# EAGLE design Voicecard-SMRMU-v01 (EAGLE 9.6.2)
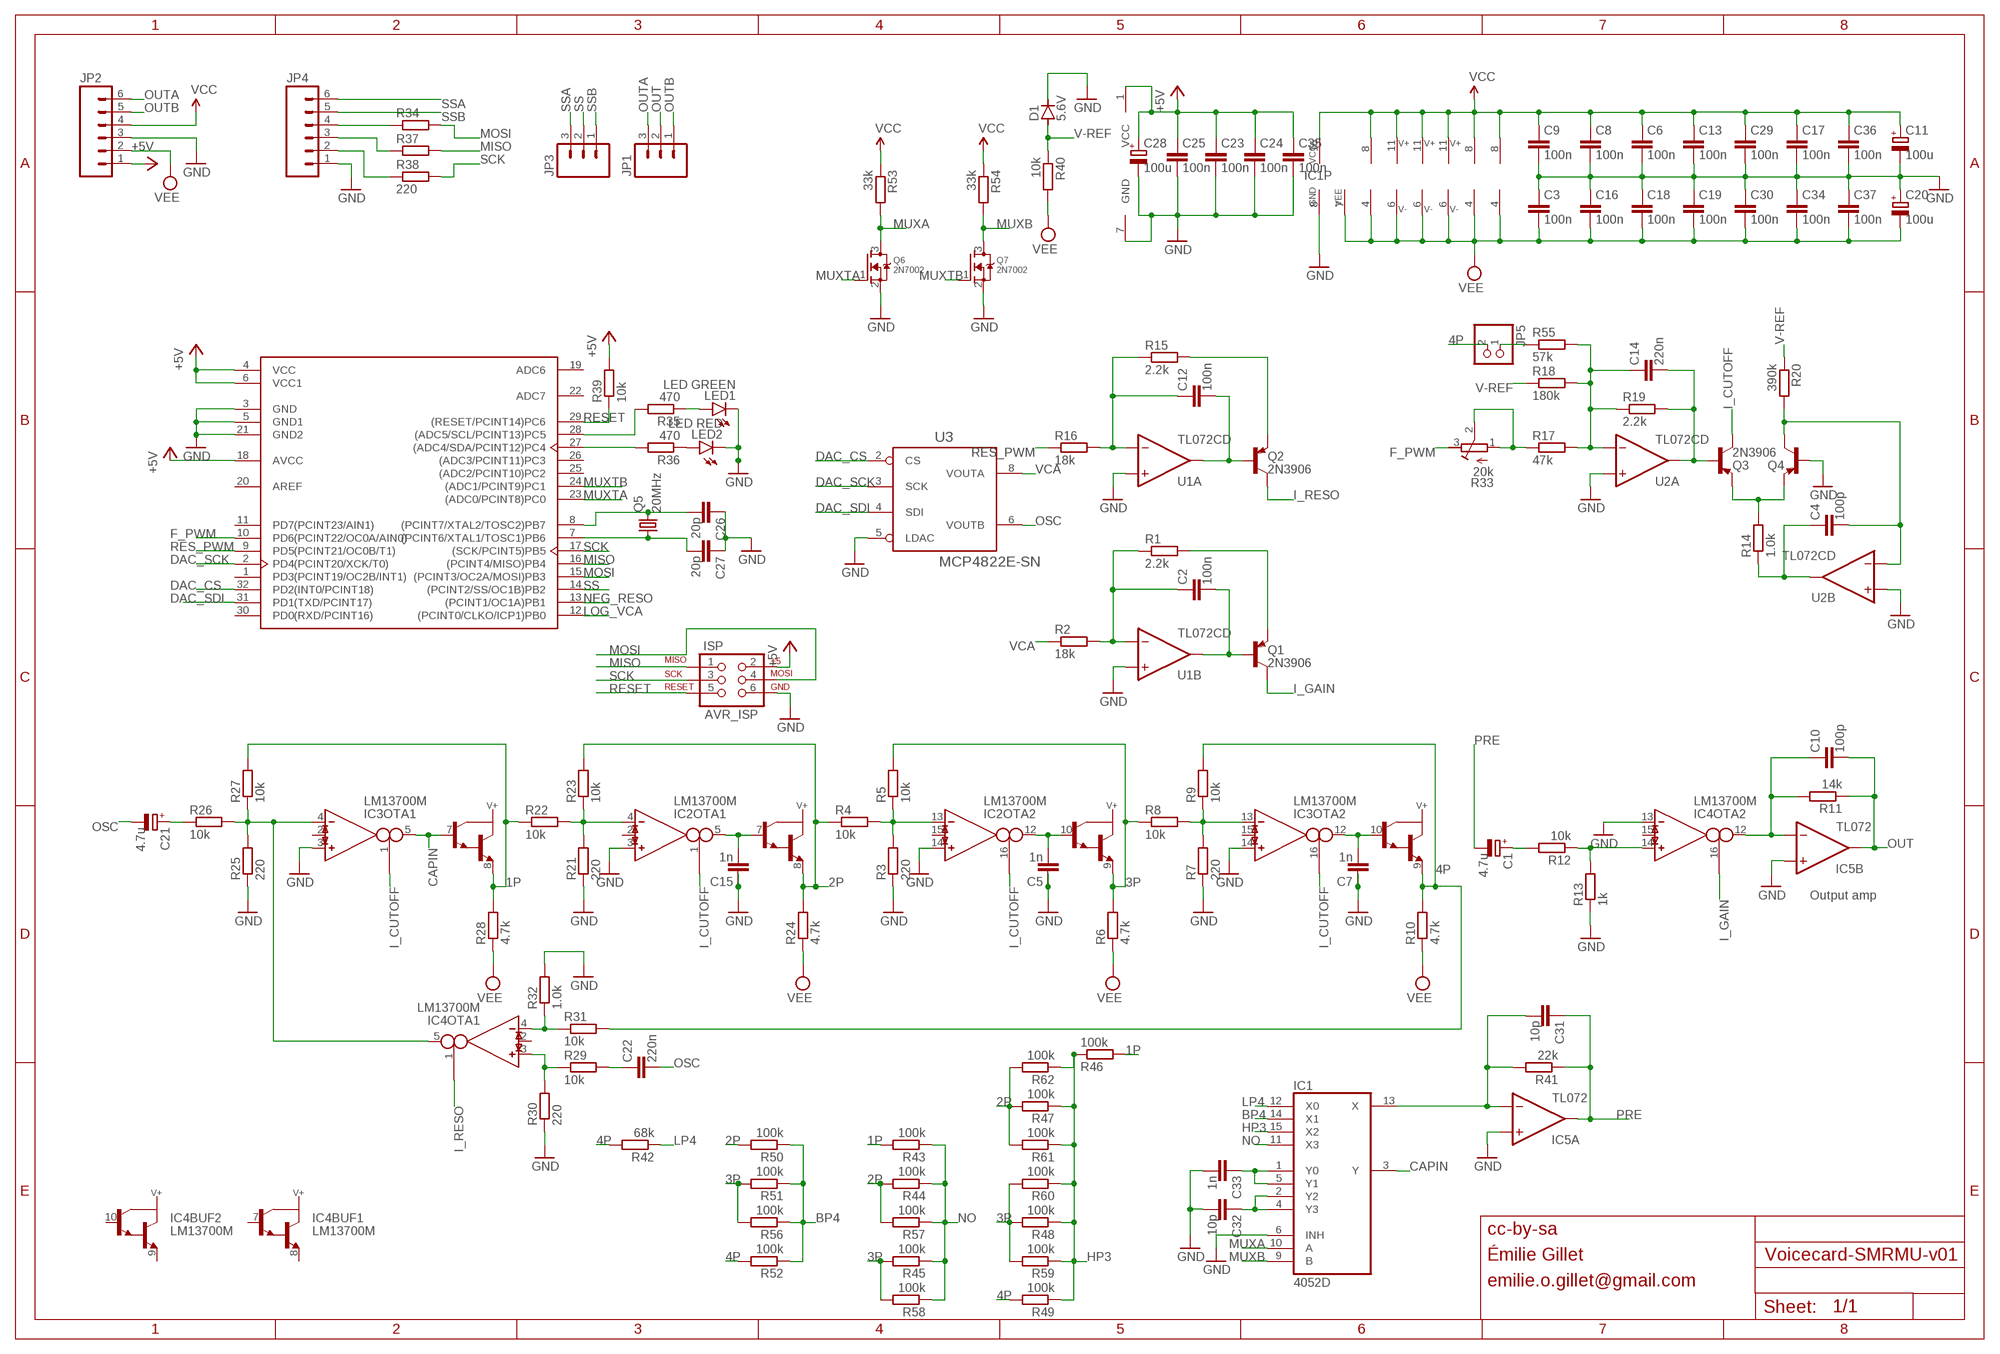
[diagram p0: schematic, sheet 1]

## Parts
C1  4.7u  CPOL-EUUD-5X5,8  [UD-5X5,8_NICHICON]
C2  100n  C-EUC0603  [C0603]
C3  100n  C-EUC0603  [C0603]
C4  100p  C-EUC0603  [C0603]
C5  1n  C-EUC0603  [C0603]
C6  100n  C-EUC0603  [C0603]
C7  1n  C-EUC0603  [C0603]
C8  100n  C-EUC0603  [C0603]
C9  100n  C-EUC0603  [C0603]
C10  100p  C-EUC0603  [C0603]
C11  100u  CPOL-EUUD-6,3X7,7  [UD-6,3X7,7_NICHICON]
C12  100n  C-EUC0603  [C0603]
C13  100n  C-EUC0603  [C0603]
C14  220n  C-EUC0603  [C0603]
C15  1n  C-EUC0603  [C0603]
C16  100n  C-EUC0603  [C0603]
C17  100n  C-EUC0603  [C0603]
C18  100n  C-EUC0603  [C0603]
C19  100n  C-EUC0603  [C0603]
C20  100u  CPOL-EUUD-6,3X7,7  [UD-6,3X7,7_NICHICON]
C21  4.7u  CPOL-EUUD-5X5,8  [UD-5X5,8_NICHICON]
C22  220n  C-EUC0603  [C0603]
C23  100n  C-EUC0603  [C0603]
C24  100n  C-EUC0603  [C0603]
C25  100n  C-EUC0603  [C0603]
C26  20p  C-EUC0603  [C0603]
C27  20p  C-EUC0603  [C0603]
C28  100u  CPOL-EUUD-6,3X7,7  [UD-6,3X7,7_NICHICON]
C29  100n  C-EUC0603  [C0603]
C30  100n  C-EUC0603  [C0603]
C31  10p  C-EUC0603  [C0603]
C32  10p  C-EUC0603  [C0603]
C33  1n  C-EUC0603  [C0603]
C34  100n  C-EUC0603  [C0603]
C35  100n  C-EUC0603  [C0603]
C36  100n  C-EUC0603  [C0603]
C37  100n  C-EUC0603  [C0603]
D1  5.6V  DIODE-LL-34  [MELF-MLL34]
IC1  4052D  [SOIC16N]
IC2  LM13700M  [SO16]
IC3  LM13700M  [SO16]
IC4  LM13700M  [SO16]
IC5  TL072  TL072CD  [SOIC8]
ISP  AVR_ISP  AVR_SPI_PRG_6PTH  [2X3]
JP1  M03PTH  [1X03]
JP2  M06SIP  [1X06]
JP3  M03PTH  [1X03]
JP4  M06SIP  [1X06]
JP5  PINHD-1X2  [1X02]
LED1  LED GREEN  LEDCHIP-LED0603  [CHIP-LED0603]
LED2  LED RED  LEDCHIP-LED0603  [CHIP-LED0603]
Q1  2N3906  MMBT3906LT1-PNP-SOT23-BEC  [SOT23-BEC]
Q2  2N3906  MMBT3906LT1-PNP-SOT23-BEC  [SOT23-BEC]
Q3  2N3906  MMBT3906LT1-PNP-SOT23-BEC  [SOT23-BEC]
Q4  2N3906  MMBT3906LT1-PNP-SOT23-BEC  [SOT23-BEC]
Q5  20MHz  CRYSTALHC49UP  [HC49UP]
Q6  2N7002  MOSFET-NREFLOW  [SOT23]
Q7  2N7002  MOSFET-NREFLOW  [SOT23]
R1  2.2k  R-EU_R0603  [R0603]
R2  18k  R-EU_R0603  [R0603]
R3  220  R-EU_R0603  [R0603]
R4  10k  R-EU_R0603  [R0603]
R5  10k  R-EU_R0603  [R0603]
R6  4.7k  R-EU_R0603  [R0603]
R7  220  R-EU_R0603  [R0603]
R8  10k  R-EU_R0603  [R0603]
R9  10k  R-EU_R0603  [R0603]
R10  4.7k  R-EU_R0603  [R0603]
R11  14k  R-EU_R0603  [R0603]
R12  10k  R-EU_R0603  [R0603]
R13  1k  R-EU_R0603  [R0603]
R14  1.0k  R-EU_R0603  [R0603]
R15  2.2k  R-EU_R0603  [R0603]
R16  18k  R-EU_R0603  [R0603]
R17  47k  R-EU_R0603  [R0603]
R18  180k  R-EU_R0603  [R0603]
R19  2.2k  R-EU_R0603  [R0603]
R20  390k  R-EU_R0603  [R0603]
R21  220  R-EU_R0603  [R0603]
R22  10k  R-EU_R0603  [R0603]
R23  10k  R-EU_R0603  [R0603]
R24  4.7k  R-EU_R0603  [R0603]
R25  220  R-EU_R0603  [R0603]
R26  10k  R-EU_R0603  [R0603]
R27  10k  R-EU_R0603  [R0603]
R28  4.7k  R-EU_R0603  [R0603]
R29  10k  R-EU_R0603  [R0603]
R30  220  R-EU_R0603  [R0603]
R31  10k  R-EU_R0603  [R0603]
R32  1.0k  R-EU_R0603  [R0603]
R33  20k  R-TRIMM3296P  [RTRIM3296P]
R34  220  R-EU_R0603  [R0603]
R35  470  R-EU_R0603  [R0603]
R36  470  R-EU_R0603  [R0603]
R37  220  R-EU_R0603  [R0603]
R38  220  R-EU_R0603  [R0603]
R39  10k  R-EU_R0603  [R0603]
R40  10k  R-EU_R0603  [R0603]
R41  22k  R-EU_R0603  [R0603]
R42  68k  R-EU_R0603  [R0603]
R43  100k  R-EU_R0603  [R0603]
R44  100k  R-EU_R0603  [R0603]
R45  100k  R-EU_R0603  [R0603]
R46  100k  R-EU_R0603  [R0603]
R47  100k  R-EU_R0603  [R0603]
R48  100k  R-EU_R0603  [R0603]
R49  100k  R-EU_R0603  [R0603]
R50  100k  R-EU_R0603  [R0603]
R51  100k  R-EU_R0603  [R0603]
R52  100k  R-EU_R0603  [R0603]
R53  33k  R-EU_R0603  [R0603]
R54  33k  R-EU_R0603  [R0603]
R55  57k  R-EU_R0603  [R0603]
R56  100k  R-EU_R0603  [R0603]
R57  100k  R-EU_R0603  [R0603]
R58  100k  R-EU_R0603  [R0603]
R59  100k  R-EU_R0603  [R0603]
R60  100k  R-EU_R0603  [R0603]
R61  100k  R-EU_R0603  [R0603]
R62  100k  R-EU_R0603  [R0603]
U1  TL072CD  [SOIC8]
U2  TL072CD  [SOIC8]
U3  MCP4822E-SN  [SOIC8]
U4  ATMEGA328P-AU  [TQFP-32]

## Nets
1P: IC3.8(BUF1:E) R22.1 R27.2 R28.2 R43.2 R46.2
2P: IC2.8(BUF1:E) R4.1 R23.2 R24.2 R44.2 R47.2 R50.2 R57.2 R61.2 R62.2
3P: IC2.9(BUF2:E) R5.2 R6.2 R8.1 R45.2 R48.2 R51.2 R56.2 R58.2 R59.2 R60.2
4P: IC3.9(BUF2:E) JP5.2 R9.2 R10.2 R31.2 R42.2 R49.2 R52.2
+5V: C23.1 C24.1 C25.1 C28.+ C35.1 ISP.2 JP2.1 R39.2 U3.1(VCC) U4.4(VCC) U4.6(VCC1) U4.18(AVCC)
BP4: IC1.14(X1) R50.1 R51.1 R52.1 R56.1
CAPIN: IC1.3(Y) IC3.5(OTA1:OUT) IC3.7(BUF1:B)
DAC_CS: U3.2(CS) U4.32(PD2(INT0/PCINT18))
DAC_SCK: U3.3(SCK) U4.2(PD4(PCINT20/XCK/T0))
DAC_SDI: U3.4(SDI) U4.31(PD1(TXD/PCINT17))
F_PWM: R33.3(E) U4.10(PD6(PCINT22/OC0A/AIN0))
GND: C3.1 C5.1 C6.2 C7.1 C8.2 C9.2 C11.- C13.2 C15.1 C16.1 C17.2 C18.1 C19.1 C20.+ C23.2 C24.2 C25.2 C26.1 C27.1 C28.- C29.2 C30.1 C32.2 C33.2 C34.1 C35.2 C36.2 C37.1 D1.1(C) IC1.6(INH) IC1.8(GND) IC2.3(OTA1:IN_P) IC2.14(OTA2:IN_P) IC3.3(OTA1:IN_P) IC3.14(OTA2:IN_P) IC4.13(OTA2:IN_N) IC5.3(A:+IN) IC5.5(B:+IN) ISP.6 JP2.3 JP4.1 LED1.C LED2.C Q4.B Q6.2(S) Q7.2(S) R3.1 R7.1 R13.1 R21.1 R25.1 R30.1 R32.2 U1.3(A:+IN) U1.5(B:+IN) U2.3(A:+IN) U2.5(B:+IN) U3.5(LDAC) U3.7(GND) U4.3(GND) U4.5(GND1) U4.21(GND2)
HP3: IC1.15(X2) R46.1 R47.1 R48.1 R49.1 R59.1 R60.1 R61.1 R62.1
I_CUTOFF: IC2.1(OTA1:I_BIAS) IC2.16(OTA2:I_BIAS) IC3.1(OTA1:I_BIAS) IC3.16(OTA2:I_BIAS) Q3.C
I_GAIN: IC4.16(OTA2:I_BIAS) Q1.C
I_RESO: IC4.1(OTA1:I_BIAS) Q2.C
LOG_VCA: U4.12((PCINT0/CLKO/ICP1)PB0)
LP4: IC1.12(X0) R42.1
MISO: ISP.1 R37.2 U4.16((PCINT4/MISO)PB4)
MOSI: ISP.4 R34.2 U4.15((PCINT3/OC2A/MOSI)PB3)
MUXA: IC1.10(A) Q6.3(D) R53.2
MUXB: IC1.9(B) Q7.3(D) R54.2
MUXTA: Q6.1(G) U4.23((ADC0/PCINT8)PC0)
MUXTB: Q7.1(G) U4.24((ADC1/PCINT9)PC1)
N$1: Q3.E Q4.E R14.2
N$2: C14.2 Q3.B R19.2 U2.1(A:OUT)
N$3: C27.2 Q5.1 U4.7((PCINT6/XTAL1/TOSC1)PB6)
N$4: C4.2 Q4.C R20.2 U2.6(B:-IN)
N$5: C21.+ R26.1
N$6: C33.1 IC1.1(Y0) IC1.5(Y1)
N$7: LED1.A R35.1
N$8: JP4.2 R38.1
N$9: C4.1 R14.1 U2.7(B:OUT)
N$10: LED2.A R36.1
N$11: R36.2 U4.27((ADC4/SDA/PCINT12)PC4)
N$12: IC3.4(OTA1:IN_N) IC4.5(OTA1:OUT) R25.2 R26.2 R27.1
N$13: JP4.3 R37.1
N$14: C26.2 Q5.2 U4.8((PCINT7/XTAL2/TOSC2)PB7)
N$15: C31.2 IC1.13(X) IC5.2(A:-IN) R41.2
N$17: IC2.4(OTA1:IN_N) R21.2 R22.2 R23.1
N$18: JP4.4 R34.1
N$19: C15.2 IC2.5(OTA1:OUT) IC2.7(BUF1:B)
N$20: R35.2 U4.28((ADC5/SCL/PCINT13)PC5)
N$21: IC2.13(OTA2:IN_N) R3.2 R4.2 R5.1
N$22: C32.1 IC1.2(Y2) IC1.4(Y3)
N$23: C5.2 IC2.10(BUF2:B) IC2.12(OTA2:OUT)
N$24: IC3.13(OTA2:IN_N) R7.2 R8.2 R9.1
N$25: JP5.1 R55.1
N$27: C1.+ R12.2
N$28: C7.2 IC3.10(BUF2:B) IC3.12(OTA2:OUT)
N$29: IC4.4(OTA1:IN_N) R31.1 R32.1
N$30: C12.2 Q2.B U1.1(A:OUT)
N$31: C2.2 Q1.B U1.7(B:OUT)
N$32: C22.1 R29.2
N$33: IC4.3(OTA1:IN_P) R29.1 R30.2
N$34: IC4.14(OTA2:IN_P) R12.1 R13.2
N$40: C14.1 R17.2 R18.2 R19.1 R55.2 U2.2(A:-IN)
N$41: R17.1 R33.1(A) R33.2(S)
N$51: C2.1 R1.1 R2.2 U1.6(B:-IN)
N$57: C12.1 R15.1 R16.2 U1.2(A:-IN)
N$60: Q2.E R15.2
N$68: Q1.E R1.2
N$70: C10.1 IC4.12(OTA2:OUT) IC5.6(B:-IN) R11.2
NEG_RESO: U4.13((PCINT1/OC1A)PB1)
NO: IC1.11(X3) R43.1 R44.1 R45.1 R57.1 R58.1
OSC: C21.- C22.2 U3.6(VOUTB)
OUT: C10.2 IC5.7(B:OUT) JP1.2 R11.1
OUTA: JP1.3 JP2.6
OUTB: JP1.1 JP2.5
PRE: C1.- C31.1 IC5.1(A:OUT) R41.1
RES_PWM: R16.1 U4.9(PD5(PCINT21/OC0B/T1))
RESET: ISP.5 R39.1 U4.29((RESET/PCINT14)PC6)
SCK: ISP.3 R38.2 U4.17((SCK/PCINT5)PB5)
SS: JP3.2 U4.14((PCINT2/SS/OC1B)PB2)
SSA: JP3.3 JP4.6
SSB: JP3.1 JP4.5
V-REF: D1.2(A) R18.1 R20.1 R40.1
VCA: R2.1 U3.8(VOUTA)
VCC: C6.1 C8.1 C9.1 C11.+ C13.1 C17.1 C29.1 C36.1 IC1.16(VCC) IC2.11(SUPPLY:V+) IC3.11(SUPPLY:V+) IC4.11(SUPPLY:V+) IC5.8(P:V+) JP2.4 R53.1 R54.1 U1.8(P:V+) U2.8(P:V+)
VEE: C3.2 C16.2 C18.2 C19.2 C20.- C30.2 C34.2 C37.2 IC1.7(VEE) IC2.6(SUPPLY:V-) IC3.6(SUPPLY:V-) IC4.6(SUPPLY:V-) IC5.4(P:V-) JP2.2 R6.1 R10.1 R24.1 R28.1 R40.2 U1.4(P:V-) U2.4(P:V-)
Unconnected: IC2.2(OTA1:I_DIODE) IC2.15(OTA2:I_DIODE) IC3.2(OTA1:I_DIODE) IC3.15(OTA2:I_DIODE) IC4.2(OTA1:I_DIODE) IC4.7(BUF1:B) IC4.8(BUF1:E) IC4.9(BUF2:E) IC4.10(BUF2:B) IC4.15(OTA2:I_DIODE) U4.1(PD3(PCINT19/OC2B/INT1)) U4.11(PD7(PCINT23/AIN1)) U4.19(ADC6) U4.22(ADC7) U4.25((ADC2/PCINT10)PC2) U4.26((ADC3/PCINT11)PC3) U4.30(PD0(RXD/PCINT16))

## Notes on the sheet
- Output amp
- cc-by-sa
- Émilie Gillet
- emilie.o.gillet@gmail.com

## Power pins joined to a net without a drawn wire
AREF: U4.20(AREF)

## Library data of the parts
C1 C11 C20 C21 C28 = jhbruhn-cdr:CPOL-EU: POLARIZED CAPACITOR, European symbol; SPICEPREFIX: C
C2-C10 C12-C19 C22-C27 C29-C37 = jhbruhn-cdr:C-EU: CAPACITOR, European symbol; SPICEPREFIX: C
D1 = jhbruhn-cdr:DIODE-: DIODE
IC1 = jhbruhn-ic:4052: 8-channel ANALOG MULTIPLEXER
IC2-IC4 = jhbruhn-ota:LM13700: Dual OTA with buffers
IC5 U1 U2 = jhbruhn-opamp:TL072: Generic Dual Op Amp
ISP = SparkFun:AVR_SPI_PRG_6: AVR ISP 6 Pin This is the reduced ISP connector for AVR programming. Common on Arduino. This footprint will take up less PCB space and can be used with a 10-pin to 6-pin adapter such as SKU: BOB-08508
JP1 JP3 = SparkFun:M03: Header 3 Standard 3-pin 0.1" header. Use with straight break away headers (SKU : PRT-00116), right angle break away headers (PRT-00553), swiss pins (PRT-00743), machine pins (PRT-00117), and female headers (PRT-00115). Molex polarized connector foot print use with SKU : PRT-08232 with associated crimp pins and housings.
JP2 JP4 = SparkFun:M06: Header 6 Standard 6-pin 0.1" header. Use with straight break away headers (SKU : PRT-00116), right angle break away headers (PRT-00553), swiss pins (PRT-00743), machine pins (PRT-00117), and female headers (PRT-00115). Molex polarized connector foot print use with SKU : PRT-08094 with associated crimp pins and housings. NOTES ON THE VARIANTS LOCK and LOCK_LONGPADS... This footprint was designed to help hold the alignment of a through-hole component (i.e. 6-pin header) while soldering it into place. You may notice that each hole has been shifted either up or down by 0.005 of an inch from it's more standard position (which is a perfectly straight line). This slight alteration caused the pins (the squares in the middle) to touch the edges of the holes. Because they are alternating, it causes a "brace" to hold the component in place. 0.005 has proven to be the perfect amount of "off-center" position when using our standard breakaway headers. Although looks a little odd when you look at the bare footprint, once you have a header in there, the alteration is very hard to notice. Also, if you push a header all the way into place, it is covered up entirely on the bottom side. This idea of altering the position of holes to aid alignment will be further integrated into the Sparkfun Library for other footprints. It can help hold any component with 3 or more connection pins.
JP5 = pinhead:PINHD-1X2: PIN HEADER
LED1 LED2 = led:LED: LED OSRAM: - CHIPLED LG R971, LG N971, LY N971, LG Q971, LY Q971, LO R971, LY R971 LH N974, LH R974 LS Q976, LO Q976, LY Q976 LO Q996 - Hyper CHIPLED LW Q18S LB Q993, LB Q99A, LB R99A - SideLED LS A670, LO A670, LY A670, LG A670, LP A670 LB A673, LV A673, LT A673, LW A673 LH A674 LY A675 LS A676, LA A676, LO A676, LY A676, LW A676 LS A679, LY A679, LG A679 - Hyper Micro SIDELED® LS Y876, LA Y876, LO Y876, LY Y876 LT Y87S - SmartLED LW L88C, LW L88S LB L89C, LB L89S, LG L890 LS L89K, LO L89K, LY L89K LS L896, LA L896, LO L896, LY L896 - TOPLED LS T670, LO T670, LY T670, LG T670, LP T670 LSG T670, LSP T670, LSY T670, LOP T670, LYG T670 LG T671, LOG T671, LSG T671 LB T673, LV T673, LT T673, LW T673 LH T674 LS T676, LA T676, LO T676, LY T676, LB T676, LH T676, LSB T676, LW T676 LB T67C, LV T67C, LT T67C, LS T67K, LO T67K, LY T67K, LW E67C LS E67B, LA E67B, LO E67B, LY E67B, LB E67C, LV E67C, LT E67C LW T67C LS T679, LY T679, LG T679 LS T770, LO T770, LY T770, LG T770, LP T770 LB T773, LV T773, LT T773, LW T773 LH T774 LS E675, LA E675, LY E675, LS T675 LS T776, LA T776, LO T776, LY T776, LB T776 LHGB T686 LT T68C, LB T68C - Hyper Mini TOPLED® LB M676 - Mini TOPLED Santana® LG M470 LS M47K, LO M47K, LY M47K Source: http://www.osram.convergy.de LUXEON: - LUMILED® LXK2-PW12-R00, LXK2-PW12-S00, LXK2-PW14-U00, LXK2-PW14-V00 LXK2-PM12-R00, LXK2-PM12-S00, LXK2-PM14-U00 LXK2-PE12-Q00, LXK2-PE12-R00, LXK2-PE12-S00, LXK2-PE14-T00, LXK2-PE14-U00 LXK2-PB12-K00, LXK2-PB12-L00, LXK2-PB12-M00, LXK2-PB14-N00, LXK2-PB14-P00, LXK2-PB14-Q00 LXK2-PR12-L00, LXK2-PR12-M00, LXK2-PR14-Q00, LXK2-PR14-R00 LXK2-PD12-Q00, LXK2-PD12-R00, LXK2-PD12-S00 LXK2-PH12-R00, LXK2-PH12-S00 LXK2-PL12-P00, LXK2-PL12-Q00, LXK2-PL12-R00 Source: www.luxeon.com KINGBRIGHT: KA-3528ASYC Source: www.kingbright.com
Q1-Q4 = transistor-neu-to92:*-PNP-: PNP Transistror
Q5 = crystal:CRYSTAL: CRYSTAL; OC_FARNELL: unknown; OC_NEWARK: unknown
Q6 Q7 = jhbruhn-transistor:MOSFET-N: N-Channel Mosfet 2N7002E - 60V 260mA SOT23 [Digikey: 2N7002ET1GOSTR-ND] - REEL BSH103 - 30V 850mA SOT23 [Digikey: 568-5013-1-ND]
R1-R32 R34-R62 = jhbruhn-cdr:R-EU_: RESISTOR, European symbol; SPICEPREFIX: R
R33 = rcl:R-TRIMM: Trimm resistor; SPICEMODEL: X; SPICEPREFIXL: POT
U3 = jhbruhn-dac:MCP48*2: MCP48X2 - dual channel, 8/10/12bit DAC, SPI interface, internal reference
U4 = jhbruhn-mcu:ATMEGA328P-AU: IC MCU 8BIT 32KB FLASH 32TQFP Manufacturer's datasheet <http://ww1.microchip.com/downloads/en/DeviceDoc/ATmega48A-PA-88A-PA-168A-PA-328-P-DS-DS40002061A.pdf>; CREATED_BY: PCBLayout.com; DIGIKEY_PART_NUMBER: ATMEGA328P-AU-ND; MANUFACTURER: Microchip Technology; MPN: ATMEGA328P-AU; PACKAGE: TQFP-32

## Net classes
0 default: width 0.254 mm

## Board
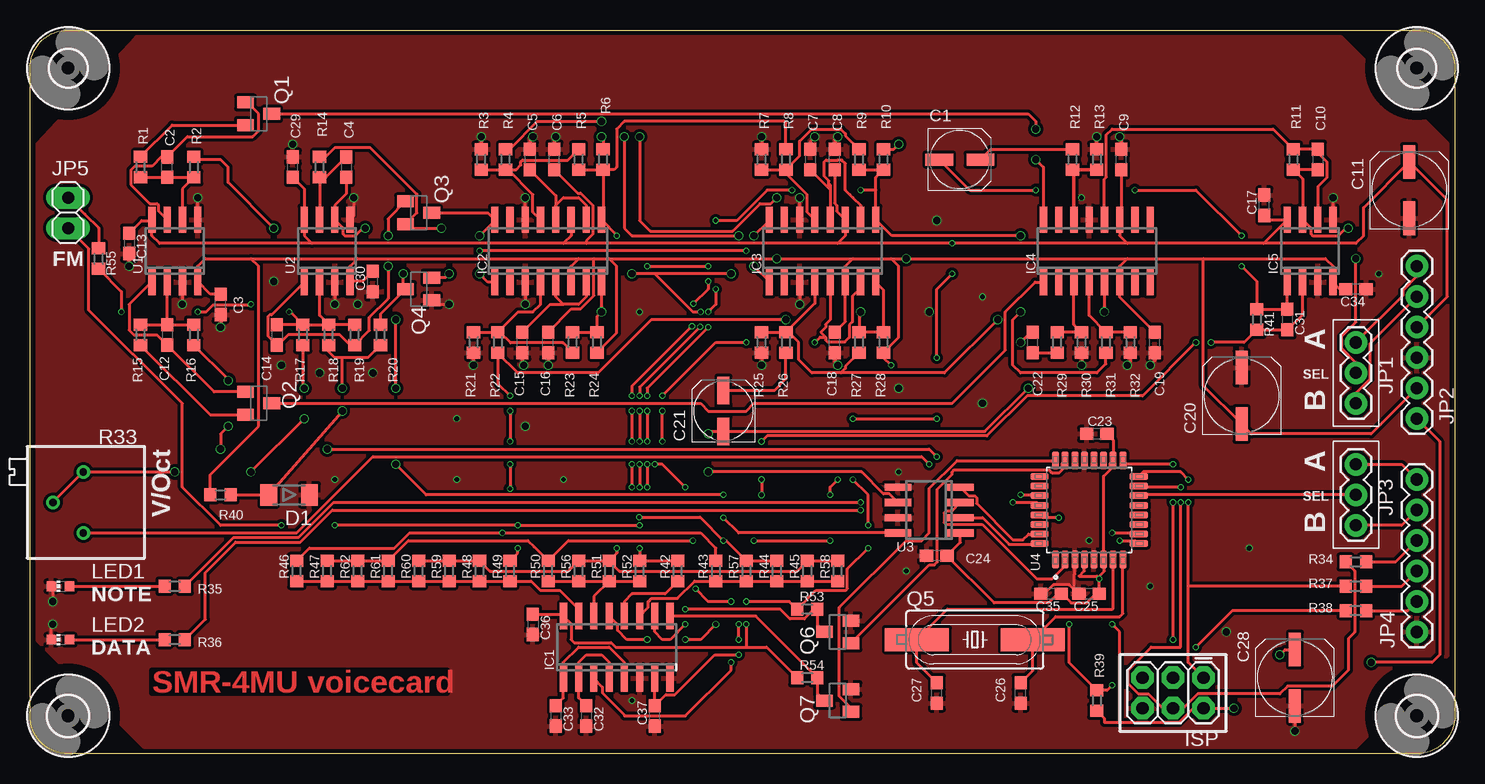
[diagram p1: board, top side]
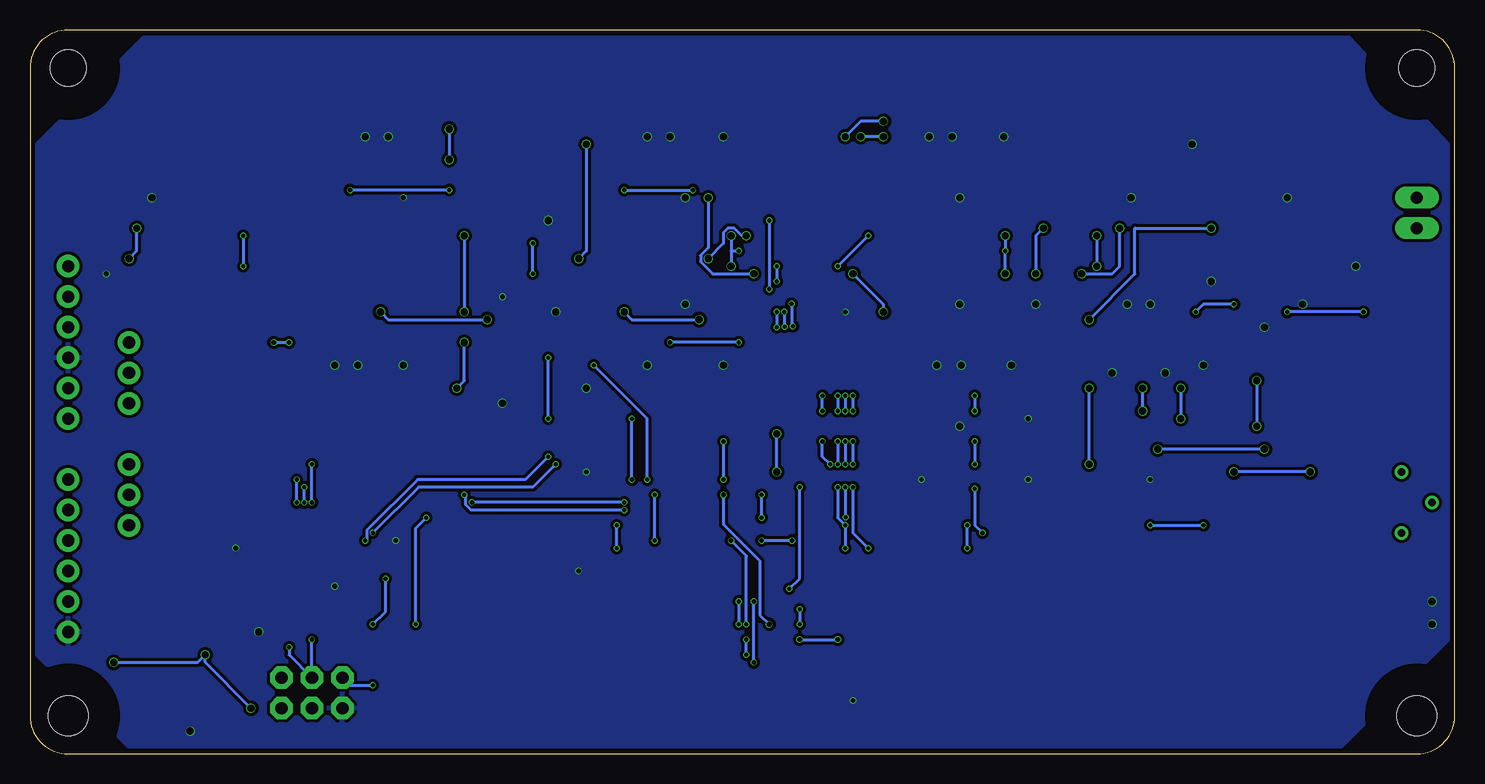
[diagram p2: board, bottom side, seen from below]

Size 118.75 x 60.33 mm. Coordinates in mm from the lower left corner, seen from the top.
Outline: 0,57.15 arc-90 3.17,60.33 115.57,60.33 arc-90 118.75,57.15 118.75,3.17 arc-90 115.57,0 3.17,0 arc-90 0,3.17 0,57.15
Copper layers (1*16): Top 0.035mm / dielectric 1.6mm / Bottom 0.035mm
Design rules "jlcpcb-2layers": minimum track width 5mil, minimum drill 0.3mm, track to track 5mil, track to pad 5mil, pad to pad 5mil, via to via 5mil, smd to smd 5mil, copper to edge 0.2mm, drill to drill 6mil, minimum pad ring 10mil, minimum via ring 3mil, stop-mask expansion 4mil, vias tented up to drill 0mil, thermal gap 10mil

### Footprints (pad centres in the part's own frame; a part is rotated, then mirrored left to right if it is on the bottom)
UD-5X5,8_NICHICON = smd 2.3 x 1: + 1.725,0; - -1.7,0
C0603 = smd 1.1 x 1: 1 -0.85,0; 2 0.85,0
UD-6,3X7,7_NICHICON = smd 2.8 x 1: + 2.35,0; - -2.35,0
MELF-MLL34 = smd 1.4 x 1.8: 1 -1.7,0; 2 1.7,0
SOIC16N = smd 0.6 x 2.2: 1 -4.445,-2.6; 2 -3.175,-2.6; 3 -1.905,-2.6; 4 -0.635,-2.6; 5 0.635,-2.6; 6 1.905,-2.6; 7 3.175,-2.6; 8 4.445,-2.6; 9 4.445,2.6; 10 3.175,2.6; 11 1.905,2.6; 12 0.635,2.6; 13 -0.635,2.6; 14 -1.905,2.6; 15 -3.175,2.6; 16 -4.445,2.6
SO16 = smd 0.6 x 2.2: 1 -4.445,-2.6; 2 -3.175,-2.6; 3 -1.905,-2.6; 4 -0.635,-2.6; 5 0.635,-2.6; 6 1.905,-2.6; 7 3.175,-2.6; 8 4.445,-2.6; 9 4.445,2.6; 10 3.175,2.6; 11 1.905,2.6; 12 0.635,2.6; 13 -0.635,2.6; 14 -1.905,2.6; 15 -3.175,2.6; 16 -4.445,2.6
SOIC8 = smd 0.6 x 2.2: 1 -1.905,-2.6; 2 -0.635,-2.6; 3 0.635,-2.6; 4 1.905,-2.6; 5 1.905,2.6; 6 0.635,2.6; 7 -0.635,2.6; 8 -1.905,2.6
2X3 = drill 1.016 pad 1.88 octagon: 1 0,0; 2 0,2.54; 3 2.54,0; 4 2.54,2.54; 5 5.08,0; 6 5.08,2.54
1X03 = drill 1.016 pad 1.88: 1 0,0; 2 2.54,0; 3 5.08,0
1X06 = drill 1.016 pad 1.88: 1 0,0; 2 2.54,0; 3 5.08,0; 4 7.62,0; 5 10.16,0; 6 12.7,0
1X02 = drill 1.016 long: 1 -1.27,0; 2 1.27,0
CHIP-LED0603 = smd 0.8 x 0.8: A 0,-0.75; C 0,0.75
SOT23-BEC = smd 1 x 1.4: B -0.95,-1.1; C 0,1.1; E 0.95,-1.1
HC49UP = smd 5.334 x 1.93: 1 -4.826,0; 2 4.826,0
SOT23 = smd 1 x 1.4: 1 -0.95,-1.1; 2 0.95,-1.1; 3 0,1.1
R0603 = smd 1 x 1.1: 1 -0.85,0; 2 0.85,0
RTRIM3296P = drill 0.61: 1 0,-2.54; 2 2.54,0; 3 0,2.54
TQFP-32 = smd 1.5 x 0.57: 1 -4.13,2.8; 2 -4.13,2; 3 -4.13,1.2; 4 -4.13,0.4; 5 -4.13,-0.4; 6 -4.13,-1.2; 7 -4.13,-2; 8 -4.13,-2.8; 17 4.13,-2.8; 18 4.13,-2; 19 4.13,-1.2; 20 4.13,-0.4; 21 4.13,0.4; 22 4.13,1.2; 23 4.13,2; 24 4.13,2.8 | smd 0.57 x 1.5: 9 -2.8,-4.13; 10 -2,-4.13; 11 -1.2,-4.13; 12 -0.4,-4.13; 13 0.4,-4.13; 14 1.2,-4.13; 15 2,-4.13; 16 2.8,-4.13; 25 2.8,4.13; 26 2,4.13; 27 1.2,4.13; 28 0.4,4.13; 29 -0.4,4.13; 30 -1.2,4.13; 31 -2,4.13; 32 -2.8,4.13
3,0 = hole 3: 0,0
3,3 = hole 3.3: 0,0

### Placement (x,y rotation side)
C1  77.47,49.53 0 top
C2  11.43,48.9 90 top
C3  15.88,37.47 90 top
C4  26.35,48.9 270 top
C5  41.66,49.53 270 top
C6  43.69,49.53 90 top
C7  65.02,49.53 270 top
C8  67.06,49.53 90 top
C9  90.93,49.53 90 top
C10  107.31,49.53 270 top
C11  114.94,46.99 90 top
C12  11.43,34.93 270 top
C13  8.26,42.55 270 top
C14  20.57,34.93 270 top
C15  41.02,34.29 90 top
C16  43.18,34.29 90 top
C17  102.87,45.72 90 top
C18  67.06,34.29 90 top
C19  93.73,34.29 90 top
C20  100.97,29.84 90 top
C21  57.78,28.57 90 top
C22  83.57,34.29 90 top
C23  88.9,26.67 180 top
C24  75.56,16.51 180 top
C25  88.27,13.33 180 top
C26  82.55,5.08 90 top
C27  75.56,5.08 90 top
C28  105.41,6.35 90 top
C29  21.91,48.9 90 top
C30  28.57,39.37 90 top
C31  104.78,36.2 270 top
C32  46.35,3.17 270 top
C33  43.81,3.17 270 top
C34  110.49,38.74 180 top
C35  85.09,13.33 180 top
C36  41.91,10.79 270 top
C37  52.07,3.17 90 top
D1  21.59,21.59 180 top
IC1  48.9,8.89 0 top
IC2  43.18,41.91 0 top
IC3  66.04,41.91 0 top
IC4  88.9,41.91 0 top
IC5  106.68,41.91 0 top
ISP  97.79,6.35 180 top
JP1  110.49,29.21 90 top
JP2  115.57,27.94 90 top
JP3  110.49,19.05 90 top
JP4  115.57,10.16 90 top
JP5  3.17,45.09 270 top
LED1  2.54,13.97 90 top
LED2  2.54,9.53 90 top
Q1  19.05,53.34 270 top
Q2  19.05,29.21 270 top
Q3  32.38,45.09 270 top
Q4  32.38,38.74 90 top
Q5  78.74,9.53 0 top
Q6  67.31,10.16 90 top
Q7  67.31,4.45 90 top
R1  9.21,48.9 90 top
R2  13.65,48.9 270 top
R3  37.59,49.53 270 top
R4  39.62,49.53 270 top
R5  45.72,49.53 270 top
R6  47.75,49.53 270 top
R7  60.96,49.53 270 top
R8  62.99,49.53 270 top
R9  69.09,49.53 270 top
R10  71.12,49.53 270 top
R11  105.28,49.53 90 top
R12  86.87,49.53 90 top
R13  88.9,49.53 270 top
R14  24.13,48.9 90 top
R15  9.21,34.93 270 top
R16  13.65,34.93 90 top
R17  22.73,34.93 90 top
R18  24.89,34.93 90 top
R19  27.05,34.93 270 top
R20  29.21,34.93 90 top
R21  36.96,34.29 90 top
R22  38.99,34.29 90 top
R23  45.21,34.29 90 top
R24  47.24,34.29 90 top
R25  60.96,34.29 90 top
R26  62.99,34.29 90 top
R27  69.09,34.29 90 top
R28  71.12,34.29 90 top
R29  85.6,34.29 270 top
R30  87.63,34.29 90 top
R31  89.66,34.29 270 top
R32  91.69,34.29 270 top
R33  4.45,20.95 180 top
R34  110.49,16 180 top
R35  12.06,13.97 0 top
R36  12.06,9.53 0 top
R37  110.49,13.97 180 top
R38  110.49,11.94 180 top
R39  88.9,4.45 270 top
R40  15.88,21.59 180 top
R41  102.23,36.2 270 top
R42  53.98,15.24 90 top
R43  57.15,15.24 90 top
R44  62.23,15.24 90 top
R45  64.77,15.24 90 top
R46  22.23,15.24 90 top
R47  24.77,15.24 90 top
R48  37.47,15.24 90 top
R49  40.01,15.24 90 top
R50  43.18,15.24 90 top
R51  48.26,15.24 90 top
R52  50.8,15.24 90 top
R53  64.77,12.06 0 top
R54  64.77,6.35 0 top
R55  5.71,41.28 270 top
R56  45.72,15.24 90 top
R57  59.69,15.24 90 top
R58  67.31,15.24 90 top
R59  34.92,15.24 90 top
R60  32.38,15.24 90 top
R61  29.84,15.24 90 top
R62  27.3,15.24 90 top
U1  12.06,41.91 0 top
U2  24.77,41.91 0 top
U3  74.93,20.32 90 top
U4  88.27,20.32 90 top
U$1  [3,0]  3.17,57.15 0 top
U$2  [3,0]  115.57,57.15 0 top
U$4  [3,3]  3.17,3.17 0 top
U$5  [3,3]  115.57,3.17 0 top

### Tracks (layer width: path | path; a pad name or v marks a point on that pad's centre or on a via)
1P  (via drill 0.35, 0.6)
  Top 0.254: IC3.8 71.12,38.68 R28.2 R27.2 69.09,36.7 v69.22,36.83 | v62.99,36.2 51.79,36.2 47.35,31.75 40.65,31.75 40.64,31.75 38.99,33.4 R22.1 38.99,30.86 v40.01,29.84 | R43.2 57.15,17.14 55.88,18.41 44.45,18.41 v39.37,18.41 31.63,18.41 30.36,17.14 23.28,17.14 R46.2 | v40.01,28.57 v40.01,26.04 | v40.01,24.13 v40.01,22.09
  Bottom 0.254: v69.22,36.83 68.58,36.2 v62.99,36.2 | v40.01,29.84 v40.01,28.57 | v40.01,26.04 v40.01,24.13 | v40.01,22.09 40.01,19.05 v39.37,18.41
2P  (via drill 0.35, 0.6)
  Top 0.254: R23.2 R24.2 47.24,36.45 v47.62,36.83 IC2.8 | R4.1 39.96,50.38 42.29,52.71 v47.62,52.71 | v50.8,51.44 50.8,44.45 51.69,43.56 58.55,43.56 60.85,45.86 61.74,45.86 v62.23,46.36 | v58.42,40.01 52.07,40.01 | 52.07,40.01 v50.16,40.01 | R47.2 R62.2 R61.2 31.54,17.78 41.49,17.78 42.02,17.25 R50.2 44.87,17.78 v55.24,17.78 | R44.2 R57.2 58,17.78 v57.78,17.78 55.84,19.72 v50.76,19.72 | 52.07,40.01 55.24,36.83 v55.88,36.83 | v55.84,35.6 50.8,30.56 v50.8,29.84 | v50.8,28.57 v50.8,26.04 | v50.8,24.13 v50.8,22.22
  Bottom 0.254: v47.62,52.71 49.53,52.71 v50.8,51.44 | v62.23,46.36 62.23,42.17 62.86,41.54 62.86,41.01 61.86,40.01 59.06,40.01 59.05,40.01 v58.42,40.01 | v50.16,40.01 47.62,37.47 v47.62,36.83 | v55.24,17.78 v57.78,17.78 | v55.88,36.83 55.88,35.64 v55.84,35.6 | v50.8,29.84 v50.8,28.57 | v50.8,26.04 v50.8,24.13 | v50.8,22.22 50.8,19.76 v50.76,19.72
3P  (via drill 0.35)
  Top 0.254: R5.2 R6.2 | R6.2 47.75,44.64 IC2.9 48.9,43.24 v48.9,43.18 | R8.1 62.99,52.58 62.87,52.71 49.53,52.71 48.9,52.07 48.9,48.9 48.68,48.68 R6.2 | R60.2 R59.2 R48.2 38.31,15.24 44.87,15.24 R56.2 R51.2 | R51.2 49.11,15.24 63.92,15.24 R45.2 R58.2 | v51.44,40.64 v56.52,40.64 | v56.52,39.37 56.52,38.74 v55.28,37.51 | v55.17,35.64 50.16,30.64 v50.16,29.84 | v50.16,28.57 v50.16,26.04 | v50.16,24.13 v50.16,22.22 | v48.9,17.14 48.9,16.73 R51.2
  Bottom 0.254: v48.9,43.18 v51.44,40.64 | v56.52,40.64 v56.52,39.37 | v55.28,37.51 55.28,35.76 v55.17,35.64 | v50.16,29.84 v50.16,28.57 | v50.16,26.04 v50.16,24.13 | v50.16,22.22 50.16,18.41 v48.9,17.14
4P  (via drill 0.35, 0.6)
  Top 0.254: R31.2 89.66,32.51 88.9,31.75 82.55,31.75 81.92,32.38 81.92,36.2 v82.55,36.83 | R9.2 R10.2 70.48,48.05 70.48,46.99 | 70.48,46.99 IC3.9 71.81,43.18 v82.55,43.18 | R49.2 40.64,16.73 v40.64,17.14 | v50.8,19.05 v40.64,19.05 v25.4,19.05 | v50.8,17.14 R52.2 R42.2 | 70.48,46.99 v69.22,46.99 | v57.15,44.45 58.9,44.45 61.43,46.99 v63.49,46.99 v63.5,46.99 | v57.15,38.74 57.15,37.47 v56.52,36.83 | v56.52,35.56 51.44,30.48 v51.44,29.84 | v51.44,28.57 v51.44,26.04 | v51.44,24.13 v51.44,22.22 | v20.95,19.05 15.88,19.05 12.7,22.22 12.7,29.21 8.59,33.32 8.55,33.32 4.91,36.96 4.91,42.08 JP5.2
  Bottom 0.254: v82.55,43.18 v82.55,36.83 | v40.64,17.14 v40.64,19.05 | v50.8,17.14 v50.8,19.05 51.44,19.68 v51.44,22.22 | v69.22,46.99 v63.5,46.99 | v57.15,44.45 v57.15,38.74 | v56.52,36.83 v56.52,35.56 | v51.44,29.84 v51.44,28.57 | v51.44,26.04 v51.44,24.13 | v25.4,19.05 v20.95,19.05
+5V  (via drill 0.35, 0.6)
  Top 0.254: 90.81,2.62 95.74,2.62 96.94,3.81 ISP.2 v100.33,3.81 | 90.81,2.62 89.53,2.62 89.53,2.96 R39.2 | v104.14,8.26 104.58,8.7 C28.+ | JP2.1 117.47,26.04 117.47,8.26 116.84,7.62 v111.76,7.62 | v89.11,14.61 C25.1 88.82,13.33 88.07,12.58 86.76,12.58 86.01,13.33 C35.1 85.65,13.33 84.89,12.58 80.34,12.58 C24.1 77.53,17.62 U3.1 | v89.11,14.61 89.11,14.82 89.53,15.24 89.53,16.12 U4.6 89.47,23.14 90,23.68 90,24.19 U4.18 90.27,26.16 C23.1 | 90.81,2.62 90.81,10.16 v90.17,10.79 | U4.4 87.86,15.26 87.42,14.81 88.91,14.81 v89.11,14.61
  Bottom 0.254: v100.33,3.81 104.14,7.62 v104.14,8.26 104.78,7.62 v111.76,7.62 | v90.17,10.79 89.11,11.85 v89.11,14.61
BP4
  Top 0.254: R50.1 R56.1 R51.1 | R51.1 R52.1 | R51.1 46.99,13.12 IC1.14
CAPIN  (via drill 0.35)
  Top 0.254: IC3.7 69.22,38.82 68.54,38.14 68.54,36 68.28,35.75 68.28,34.71 67.92,34.34 66.45,34.34 66.3,34.49 66.3,34.74 | 66.3,34.74 65.9,35.14 66.3,35.54 66.3,35.8 66.67,36.17 IC3.5 | IC1.3 47.71,5.57 47.71,5.08 49.53,3.26 49.53,3.17 54.61,3.17 58.42,6.98 v58.42,7.62 | v58.42,12.7 56.52,12.7 v55.46,13.75 | v54.61,22.22 52.7,24.13 v52.07,24.13 | v52.7,26.04 v52.7,28.57 | v52.7,29.84 57.15,34.29 v59.69,34.29 | v65.41,34.29 65.85,34.74 66.3,34.74
  Bottom 0.254: v58.42,7.62 v58.42,12.7 | v55.46,13.75 54.61,14.61 v54.61,22.22 | v52.07,24.13 52.7,24.77 v52.7,26.04 | v52.7,28.57 v52.7,29.84 | v59.69,34.29 v65.41,34.29
DAC_CS
  Top 0.254: U4.32 84.14,17.46 81.6,17.46 79.38,19.68 U3.2
DAC_SCK
  Top 0.254: U3.3 76.81,20.24 76.33,20.24 76.18,20.09 76.18,19.28 76.33,19.13 79.35,19.13 83.88,14.61 85.19,14.61 86.27,15.68 U4.2
DAC_SDI
  Top 0.254: U3.4 78.25,21.51 78.73,21.51 78.88,21.36 78.88,20.87 81.92,17.84 82.74,17.84 83.22,18.32 U4.31
F_PWM  (via drill 0.35)
  Top 0.254: U4.10 92.3,18.41 v90.17,18.41 | R33.3 22.23,18.41 28.57,24.77 74.3,24.77 v74.93,24.13
  Bottom 0.254: v74.93,24.13 76.83,22.22 86.36,22.22 v90.17,18.41
GND  (via drill 0.4, 0.6)
  Top 0.254: U1.5 v13.97,46.36 | v26.99,46.36 26.99,44.83 U2.5 | U2.3 v25.4,37.47 | U1.3 v12.7,37.47 | Q4.B 33.8,37.47 v34.92,37.47 | IC2.3 v41.27,37.47 | R21.1 v36.96,32.38 | C15.1 41.02,32.51 v41.15,32.38 | v37.59,51.44 R3.1 | C5.1 41.66,51.18 v41.91,51.44 | IC2.14 v41.27,46.36 | v60.96,51.44 R7.1 | v65.41,51.44 65.02,51.05 C7.1 | IC3.14 v64.14,46.36 | IC3.3 v64.14,37.47 | R25.1 v60.96,32.38 | R13.1 v88.9,51.44 | IC5.5 v108.58,46.36 | LED1.C 1.91,13.86 v1.91,12.7 | LED2.C 1.79,10.68 v1.91,10.79 | C28.- v105.41,1.91 | R30.1 v87.63,32.38 | R32.2 91.69,32.64 v91.44,32.38 | C16.1 v43.18,32.38 | C3.1 v15.88,35.56 | C6.2 43.69,51.31 v43.81,51.44 | C8.2 67.06,51.18 v67.31,51.44 | C18.1 67.06,32.64 v67.31,32.38 | C9.2 90.93,51.31 v90.81,51.44 | C19.1 93.73,32.77 v93.34,32.38 | v8.26,40.64 C13.2 | C35.2 84.53,13.33 85.28,14.09 86.59,14.09 87.35,13.33 C25.2 87.04,13.71 87.04,14.97 87.06,15 U4.3
  other vias: 41.27,27.3 20.32,39.37 74.93,36.83 75.56,44.45 99.69,10.16 72.39,30.48 79.38,29.21 27.3,37.47 21.91,50.8 28.57,31.75 20.95,32.38 24.13,31.75 50.16,4.45 88.27,17.78 72.39,23.5 73.03,15.24 87.63,46.36 112.39,40.01 25.4,22.86 35.56,27.94 35.56,22.86 44.45,22.86 79.38,38.1 50.8,36.83 101.6,17.14 93.34,13.97
  pour Bottom (isolate 0.254): 8.89,59.69 0.64,50.8 0.64,9.53 9.53,0.64 110.49,0.64 118.11,8.26 118.11,50.8 109.22,59.69
  pour Top (isolate 0.254): 8.89,59.69 0.64,50.8 0.64,9.53 9.53,0.64 110.49,0.64 118.11,8.26 118.11,50.8 109.22,59.69
HP3
  Top 0.254: R46.1 R47.1 R62.1 R61.1 R60.1 R59.1 R48.1 R49.1 41.77,14.39 42.52,13.64 44.15,13.64 45.72,12.06 IC1.15
I_CUTOFF  (via drill 0.35, 0.6)
  Top 0.254: Q3.C 38.16,45.09 IC2.16 38.73,44.45 v37.47,43.18 | IC2.1 38.16,39.31 v37.47,40.01 | v60.33,43.18 61.59,44.45 IC3.16 | v60.33,40.64 61.59,39.37 IC3.1 | v59.69,41.91 v37.47,41.91
  Bottom 0.254: v37.47,40.01 v37.47,41.91 v37.47,43.18 | v60.33,40.64 v60.33,43.18 60.33,41.91 v59.69,41.91
I_GAIN  (via drill 0.6)
  Top 0.254: Q1.C 83.19,53.34 83.82,52.71 v83.82,52.07 | v83.82,49.53 84.45,48.9 IC4.16
  Bottom 0.254: v83.82,52.07 v83.82,49.53
I_RESO
  Top 0.254: Q2.C 55.88,29.21 56.52,28.57 59.69,28.57 60.33,29.21 76.83,29.21 81.28,33.66 81.28,36.83 83.76,39.31 IC4.1
LP4
  Top 0.254: R42.1 52.92,13.33 50.16,13.33 49.53,12.7 IC1.12
MISO  (via drill 0.35)
  Top 0.254: R37.2 96.52,13.97 | 96.52,13.97 v96.52,20.95 | v96.52,22.86 95.89,23.5 92.77,23.5 U4.16 | ISP.1 96.52,7.62 96.52,13.97
  Bottom 0.254: v96.52,20.95 v96.52,22.86
MOSI  (via drill 0.35)
  Top 0.254: R34.2 110.39,15.25 110.39,10.14 109.86,9.6 109.86,6.98 108.52,5.65 104.81,5.65 104.16,5 97.3,5 96.1,3.81 ISP.4 94.4,3.81 93.2,5 92.37,5 91.52,5.86 91.52,6.98 93.42,8.89 95.89,8.89 v95.89,20.95 | v95.89,22.22 92.49,22.22 U4.15
  Bottom 0.254: v95.89,20.95 v95.89,22.22
MUXA  (via drill 0.35)
  Top 0.254: Q6.3 65.62,10.75 R53.2 65.33,12.06 64.53,11.26 63.31,11.26 62.51,12.06 v54.61,12.06 | IC1.10 52.07,10.16 52.7,9.53 53.34,9.53 v54.61,10.79
  Bottom 0.254: v54.61,12.06 v54.61,10.79
MUXB
  Top 0.254: Q7.3 65.62,5.04 R54.2 60.48,11.49 IC1.9
MUXTA
  Top 0.254: Q6.1 74.96,15.76 75.37,15.76 75.61,16 75.61,22.07 76.83,23.29 76.83,23.5 77,23.66 84.94,23.66 85.16,23.45 85.77,23.45 86,23.68 86,24.19 U4.23
MUXTB
  Top 0.254: Q7.1 68.41,3.84 67.46,4.79 67.46,12.21 73.03,17.78 74.3,17.78 74.93,18.41 74.93,22.13 77.25,24.45 U4.24
N$1  (via drill 0.6)
  Top 0.254: R14.2 24.63,49.75 25.43,50.55 28.33,50.55 32.24,46.64 32.24,45.09 Q3.E 31.61,43.82 v34.29,43.82 | v34.92,40.01 34.6,39.69 Q4.E
  Bottom 0.254: v34.29,43.82 34.92,43.18 v34.92,40.01
N$2  (via drill 0.6)
  Top 0.254: U2.1 20.13,36.58 19.97,36.58 19.82,36.43 19.82,34.83 C14.2 20.86,34.37 20.95,34.37 21.51,34.93 25.82,34.93 26.56,34.18 26.75,34.37 R19.2 28.28,35.3 28.28,36.38 29.84,37.95 v29.84,40.64 | Q3.B 29.84,44.6 v29.84,43.18
  Bottom 0.254: v29.84,43.18 v29.84,40.64
N$3
  Top 0.254: C27.2 73.91,7.58 Q5.1 76.45,12.06 90.17,12.06 90.27,12.16 U4.7
N$4  (via drill 0.6)
  Top 0.254: R20.2 29.21,36.66 Q4.C 31.11,38.91 v31.11,40.01 | C4.2 26.35,46.67 25.4,45.72 U2.6 26.12,43.79 26.12,43.3 26.27,43.16 27.07,43.16 27.73,43.82 v27.94,43.82
  Bottom 0.254: v31.11,40.01 28.57,40.01 27.94,40.64 v27.94,43.82
N$5
  Top 0.254: C21.+ 62.05,30.3 62.99,31.24 R26.1
N$6
  Top 0.254: C33.1 44.45,4.66 IC1.1 44.45,7.62 45.72,8.89 48.26,8.89 49.53,7.62 IC1.5
N$7
  Top 0.254: LED1.A R35.1
N$8
  Top 0.254: R38.1 114.81,11.94 JP4.2
N$9
  Top 0.254: C4.1 24.65,48.05 R14.1 U2.7
N$10
  Top 0.254: LED2.A R36.1
N$11  (via drill 0.35)
  Top 0.254: R36.2 14.61,11.21 14.61,15.11 17.14,17.65 22.54,17.65 25.21,20.32 v69.22,20.32 | v82.55,21.59 84.06,21.59 U4.27
  Bottom 0.254: v82.55,21.59 82.42,21.46 82.42,20.75 81.99,20.32 v69.22,20.32
N$12  (via drill 0.6)
  Top 0.254: R25.2 R26.2 | IC3.4 65.41,37.55 R26.2 | R27.1 67.94,32.29 67.94,32.12 67.57,31.75 | R26.2 63.21,35.14 64.05,34.3 64.05,32.85 65.15,31.75 67.57,31.75 | IC4.5 v89.53,36.83 | v80.64,36.2 76.2,31.75 67.57,31.75
  Bottom 0.254: v89.53,36.83 88.9,36.2 v80.64,36.2
N$13
  Top 0.254: R37.1 114.3,13.97 JP4.3
N$14
  Top 0.254: C26.2 83.57,6.95 Q5.2 85.47,11.43 90.81,11.43 91.06,11.69 U4.8
N$15  (via drill 0.4)
  Top 0.254: IC5.2 106.05,36.62 C31.2 R41.2 101.18,34.29 v98.42,34.29 | v97.16,34.29 92.71,29.84 83.09,29.84 79.74,26.49 61.42,26.49 v60.96,26.04 | v60.96,22.86 v60.96,21.59 | v57.15,10.79 55.88,9.53 v54.61,9.53 | IC1.13 48.98,10.77 48.98,10.29 49.74,9.53 v51.44,9.53
  Bottom 0.254: v98.42,34.29 v97.16,34.29 | v60.96,26.04 v60.96,22.86 | v60.96,21.59 60.96,19.13 57.91,16.08 57.91,11.56 v57.15,10.79 | v54.61,9.53 v51.44,9.53
N$17
  Top 0.254: R22.2 40.68,36.83 41.91,36.83 42.55,37.47 IC2.4 | R21.2 R22.2 | R23.1 45.21,33.45 44.42,34.24 40.05,34.24 39.16,35.14 R22.2
N$18
  Top 0.254: R34.1 113.79,16 JP4.4
N$19
  Top 0.254: IC2.7 46.35,38.1 45.72,37.47 44.45,37.47 | 44.45,37.47 43.81,38.1 IC2.5 | C15.2 43.35,37.47 44.45,37.47
N$20  (via drill 0.35)
  Top 0.254: R35.2 16.98,18.03 22.38,18.03 25.3,20.95 v69.22,20.95 | v81.92,20.95 83.9,20.95 U4.28
  Bottom 0.254: v69.22,20.95 v81.92,20.95
N$21
  Top 0.254: R3.2 R4.2 | R5.1 44.98,49.64 44.82,49.48 41.05,49.48 40.9,49.34 40.9,49.08 40.5,48.68 R4.2 | IC2.13 41.91,45.15 41.91,46.62 39.84,48.68 R4.2
N$22
  Top 0.254: C32.1 45.72,4.66 IC1.2 45.72,7.62 46.35,8.26 47.62,8.26 48.26,7.62 IC1.4
N$23
  Top 0.254: C5.2 43.81,46.52 IC2.12 43.81,45.72 44.45,46.36 45.72,46.36 46.35,45.72 IC2.10
N$24
  Top 0.254: R7.2 R8.2 | IC3.13 64.77,45.15 64.77,46.62 62.99,48.39 R8.2 | R8.2 64.14,49.83 64.14,51.06 65.14,52.07 65.4,52.07 65.41,52.07 67.57,52.07 67.94,51.7 67.94,51.53 R9.1
N$25
  Top 0.254: JP5.1 4.55,44.98 4.57,44.98 5.71,43.84 R55.1
N$27
  Top 0.254: C1.+ 80.05,50.38 R12.2
N$28
  Top 0.254: C7.2 66.57,47.14 66.57,47.52 | 66.57,47.52 66.67,47.41 IC3.12 | 66.57,47.52 66.57,47.76 66.17,48.15 66.17,49.34 66.32,49.48 67.31,49.48 67.66,49.48 67.94,49.2 67.94,46.99 68.33,46.61 68.58,46.36 69.22,45.72 IC3.10
N$29
  Top 0.254: R32.1 R31.1 88.27,36.54 IC4.4
N$30
  Top 0.254: U1.1 10.1,39.31 8.26,37.47 8.26,35.32 8.65,34.93 10.58,34.93 C12.2 15.35,30.16 Q2.B
N$31
  Top 0.254: U1.7 10.71,45.23 10.71,45.72 10.56,45.86 9.98,45.86 8.4,47.44 8.4,48.65 8.74,48.99 10.18,48.99 10.93,49.75 C2.2 13.12,51.44 18.55,51.44 19.05,51.93 19.05,53.34 18.1,54.29 Q1.B
N$32
  Top 0.254: C22.1 R29.2
N$33
  Top 0.254: R29.1 R30.2 87,35.78 IC4.3
N$34
  Top 0.254: R12.1 87,48.68 | 87,48.68 R13.2 R12.1 | 87,48.68 IC4.14 87,48.55 R12.1
N$40  (via drill 0.35)
  Top 0.254: R19.1 R18.2 | R17.2 C14.1 | R17.2 R18.2 | R18.2 24.13,36.54 U2.2 | v13.97,36.83 14.68,36.83 15.27,37.42 18.37,37.42 v18.41,37.47 | v21.59,36.83 21.68,36.83 R17.2 | R55.2 7.62,38.52 v7.62,36.83
  Bottom 0.254: v18.41,37.47 20.95,37.47 v21.59,36.83 | v7.62,36.83 v13.97,36.83
N$41  (via drill 0.6)
  Top 0.254: R33.2 R33.1 v12.06,23.5 | R17.1 22.73,30.61 v22.86,30.48 | v22.86,27.94 v18.41,23.5
  Bottom 0.254: v22.86,30.48 v22.86,27.94 | v12.06,23.5 v18.41,23.5
N$51
  Top 0.254: R1.1 C2.1 R2.2 12.7,47.09 U1.6
N$57
  Top 0.254: R15.1 C12.1 | C12.1 R16.2 | C12.1 U1.2
N$60
  Top 0.254: R15.2 15.02,28.26 Q2.E
N$68
  Top 0.254: R1.2 11.85,52.39 Q1.E
N$70
  Top 0.254: IC4.12 89.53,47.91 89.7,48.08 89.7,51.6 90.17,52.07 103.59,52.07 R11.2 C10.1 107.31,50.09 108.07,49.34 108.07,48.03 107.31,47.27 IC5.6
NO
  Top 0.254: IC1.11 51.52,12.21 51.52,12.7 51.77,12.95 53.95,12.95 55.38,14.39 R43.1 R57.1 R44.1 R45.1 R58.1
OSC  (via drill 0.6)
  Top 0.254: v56.52,26.67 56.72,26.88 C21.- 79.58,26.88 v83.19,30.48 | v82.55,34.29 83.4,35.14 C22.2 | U3.6 71.61,21.67 71.12,21.67 69.3,23.5 v56.52,23.5
  Bottom 0.254: v56.52,23.5 v56.52,26.67 | v83.19,30.48 82.55,31.11 v82.55,34.29
OUT  (via drill 0.6)
  Top 0.254: C10.2 R11.1 106.05,47.92 IC5.7 106.76,43.79 106.76,43.3 106.91,43.16 108.99,43.16 109.65,43.82 v109.86,43.82 | JP1.2 110.49,32.6 109.3,33.8 109.3,34.78 110.49,35.98 v110.49,41.28
  Bottom 0.254: v110.49,41.28 109.86,41.91 v109.86,43.82
OUTA
  Top 0.254: JP1.3 114.38,38.18 114.38,38.59 115.57,39.79 JP2.6
OUTB
  Top 0.254: JP2.5 111.68,34.21 111.68,31.26 110.49,30.06 JP1.1
PRE  (via drill 0.35)
  Top 0.254: C1.- 78.31,46.99 v83.82,46.99 | v92.08,46.99 97.16,46.99 v100.97,43.18 | v100.97,40.64 102.23,39.37 R41.1 C31.1 IC5.1
  Bottom 0.254: v83.82,46.99 v92.08,46.99 | v100.97,43.18 v100.97,40.64
RES_PWM  (via drill 0.35, 0.6)
  Top 0.254: v16.51,31.11 16.51,31.22 R16.1 | v16.51,27.3 15.88,26.67 v15.88,25.4 | U4.9 92.36,17.49 92.08,17.78 v90.81,17.78 | v75.56,24.77 74.93,25.4 v24.77,25.4
  Bottom 0.254: v16.51,31.11 v16.51,27.3 | v15.88,25.4 v24.77,25.4 | v75.56,24.77 77.47,22.86 86.44,22.86 90.67,18.62 90.67,17.91 v90.81,17.78
RESET  (via drill 0.35)
  Top 0.254: v90.17,5.71 89.75,5.29 R39.1 86.61,7.58 v86.61,10.79 | U4.29 84.37,19.68 v85.72,19.68
  Bottom 0.254: ISP.5 92.08,5.71 v90.17,5.71 | v86.61,10.79 86.61,18.8 v85.72,19.68
SCK  (via drill 0.35)
  Top 0.254: R38.2 100.2,11.94 v97.16,8.89 | v95.25,9.53 v95.25,20.95 | v95.25,24.13 91.39,24.13 U4.17
  Bottom 0.254: v97.16,8.89 97.16,8.26 ISP.3 v95.25,9.53 | v95.25,20.95 v95.25,24.13
SS
  Top 0.254: U4.14 92.47,21.59 JP3.2
SSA
  Top 0.254: JP3.3 114.3,24.13 JP4.6
SSB
  Top 0.254: JP4.5 114.3,19.05 JP3.1
V-REF  (via drill 0.6)
  Top 0.254: R20.1 28.16,33.02 26.04,33.02 | 26.04,33.02 25.4,33.02 24.89,33.53 R18.1 | R40.1 D1.2 v26.04,28.57 | v26.04,30.48 26.04,33.02
  Bottom 0.254: v26.04,28.57 v26.04,30.48
VCA  (via drill 0.35, 0.6)
  Top 0.254: v30.48,30.48 v30.48,36.2 | R2.1 13.87,49.53 15.88,49.53 16.51,48.9 16.51,47.62 v20.32,43.82 | U3.8 59.05,18.41 v57.78,19.68 | v57.78,21.59 33.02,21.59 v30.48,24.13
  Bottom 0.254: v30.48,24.13 v30.48,30.48 | v30.48,36.2 26.67,40.01 26.67,43.82 v20.32,43.82 | v57.78,19.68 v57.78,21.59
VCC  (via drill 0.35)
  Top 0.254: 102.81,42.55 IC5.8 103.23,44.51 C17.1 | 102.81,42.55 91.44,42.55 | 91.44,42.55 v76.83,42.55 67.31,42.55 | 67.31,42.55 46.35,42.55 | 46.35,42.55 44.45,42.55 | 44.45,42.55 23.5,42.55 | 23.5,42.55 10.79,42.55 10.16,43.18 10.16,44.45 | 10.16,44.45 U1.8 | 67.31,42.55 67.94,43.18 IC3.11 67.23,45.23 67.23,45.72 67.06,45.89 C8.1 | IC2.11 45.09,43.18 44.45,42.55 | 23.5,42.55 22.86,43.18 U2.8 22.86,47.09 C29.1 | 102.81,42.55 110.49,42.55 111.12,43.18 111.12,45.53 C11.+ 118.11,46.17 118.11,38.1 JP2.4 | C9.1 90.93,44.64 IC4.11 90.81,43.18 91.44,42.55 | C13.1 9.31,44.45 10.16,44.45 | C6.1 45.63,46.74 45.89,46.74 46.91,45.72 46.91,43.3 46.35,42.75 46.35,42.55 | C36.1 44.3,11.64 IC1.16 45.09,10.86 45.09,9.53 45.34,9.27 48.42,9.27 48.8,8.89 59.69,8.89 | R54.1 61.38,8.89 59.69,8.89 | v59.69,12.7 63.28,12.7 R53.1 65.49,13.64 67.97,13.64 68.11,13.79 68.11,15.41 v69.85,17.14 | v59.69,10.79 59.69,8.89 | v69.85,19.05 69.85,21.59 v68.58,22.86 | v68.58,27.94 v75.56,27.94 | v75.56,33.02 75.56,38.74 v76.83,40.01
  Bottom 0.254: v59.69,12.7 v59.69,10.79 | v69.85,17.14 v69.85,19.05 | v68.58,22.86 v68.58,27.94 | v75.56,27.94 v75.56,33.02 | v76.83,40.01 v76.83,42.55
VEE  (via drill 0.35, 0.6)
  Top 0.254: U1.4 13.97,39.37 | 13.97,39.37 13.97,40.64 14.61,41.28 18.41,41.28 | 18.41,41.28 27.3,41.28 | 27.3,41.28 45.72,41.28 | 45.72,41.28 46.99,41.28 | 46.99,41.28 48.26,41.28 | 48.26,41.28 v62.23,41.28 68.58,41.28 | 68.58,41.28 71.75,41.28 | 71.75,41.28 v73.03,41.28 91.44,41.28 | 91.44,41.28 97.79,41.28 | 97.79,41.28 107.95,41.28 108.58,40.64 IC5.4 109.16,38.74 C34.2 | 91.44,41.28 90.81,40.64 IC4.6 90.81,38.06 C19.2 | 68.58,41.28 67.94,40.64 IC3.6 67.94,36.03 C18.2 | IC2.6 45.09,40.64 45.72,41.28 | U2.4 26.67,39.37 | 26.67,39.37 26.67,40.64 27.3,41.28 | JP2.2 111.76,26.67 101.79,26.67 C20.- 97.79,30.67 97.79,41.28 | C3.2 15.03,38.32 13.97,39.37 | C16.2 45.12,37.08 45.89,37.08 46.99,38.19 46.99,41.28 | R24.1 48.9,35.09 48.9,40.64 48.26,41.28 | R40.2 15.03,23.28 19.05,27.3 19.05,40.64 18.41,41.28 | 71.75,41.28 72.39,40.64 72.39,34.71 R28.1 71.12,33.02 v71.75,32.38 | R10.1 71.97,50.38 v72.39,50.8 | R6.1 47.75,51.31 v47.62,51.44 | v49.53,51.44 49.53,43.82 50.16,43.18 v59.05,43.18 | C30.2 27.73,39.37 26.67,39.37 | IC1.7 C37.2 52.98,4.94 53.74,4.94 57.06,8.26 v59.05,8.26 | v59.05,9.53 v59.05,10.79 | v66.67,21.59 66.67,22.22 v67.31,22.86 | v60.33,17.78 v66.67,17.78
  Bottom 0.254: v72.39,50.8 72.39,41.91 v73.03,41.28 | v47.62,51.44 v49.53,51.44 | v59.05,43.18 59.43,43.18 60.06,43.81 60.59,43.81 60.95,43.44 60.95,42.55 v62.23,41.28 | v59.05,8.26 v59.05,9.53 | v59.05,10.79 59.05,16.51 v60.33,17.78 | v66.67,17.78 v66.67,21.59 | v67.31,22.86 67.31,27.94 v71.75,32.38

### Text on the board
Top: SMR-4MU voicecard
tNames: FM | A | SEL | B | V/Oct | A | SEL | B | NOTE | DATA
tStop: cc-by-sa | SMR-4MU voicecard | Émilie Gillet, jhbruhn | v0.1